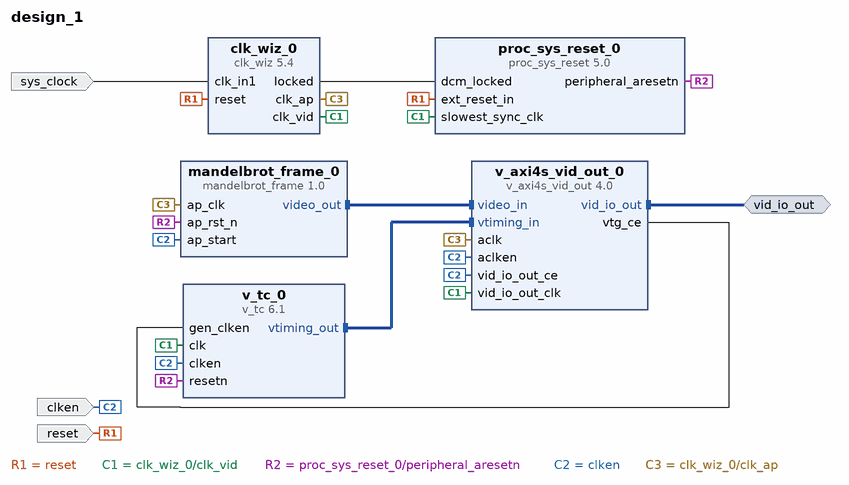
[diagram p0: block diagram of the top level]
# Vivado block design design_1, xc7a35tcpg236-1, Vivado 2017.4
create_bd_design design_1

create_bd_intf_port -mode Master -vlnv xilinx.com:interface:vid_io_rtl:1.0 vid_io_out
create_bd_port -dir I -type clk sys_clock
set_property -dict {CONFIG.FREQ_HZ 100000000 CONFIG.PHASE 0.000} [get_bd_ports sys_clock]
create_bd_port -dir I -type rst reset
set_property -dict {CONFIG.POLARITY ACTIVE_HIGH} [get_bd_ports reset]
create_bd_port -dir I -type ce clken

create_bd_cell -type ip -vlnv xilinx.com:ip:clk_wiz:5.4 clk_wiz_0
set_property -dict [list \
  CONFIG.CLKOUT2_USED true \
  CONFIG.NUM_OUT_CLKS 2 \
  CONFIG.CLK_OUT1_PORT clk_ap \
  CONFIG.CLK_OUT2_PORT clk_vid \
  CONFIG.CLKOUT1_REQUESTED_OUT_FREQ 450.000 \
  CONFIG.CLKOUT2_REQUESTED_OUT_FREQ 25.000 \
  CONFIG.MMCM_DIVCLK_DIVIDE 1 \
  CONFIG.MMCM_CLKFBOUT_MULT_F 9.000 \
  CONFIG.MMCM_CLKOUT0_DIVIDE_F 2.000 \
  CONFIG.MMCM_CLKOUT1_DIVIDE 36 \
  CONFIG.USE_BOARD_FLOW true \
  CONFIG.CLK_IN1_BOARD_INTERFACE sys_clock \
  CONFIG.RESET_BOARD_INTERFACE reset \
  CONFIG.CLKOUT1_JITTER 103.830 \
  CONFIG.CLKOUT1_PHASE_ERROR 105.461 \
  CONFIG.CLKOUT2_JITTER 183.467 \
  CONFIG.CLKOUT2_PHASE_ERROR 105.461 \
] [get_bd_cells clk_wiz_0]
create_bd_cell -type ip -vlnv xilinx.com:ip:proc_sys_reset:5.0 proc_sys_reset_0
set_property -dict {CONFIG.USE_BOARD_FLOW true CONFIG.RESET_BOARD_INTERFACE reset} [get_bd_cells proc_sys_reset_0]
create_bd_cell -type ip -vlnv xilinx.com:ip:v_tc:6.1 v_tc_0
set_property -dict [list \
  CONFIG.HAS_AXI4_LITE false \
  CONFIG.VIDEO_MODE 640x480p \
  CONFIG.enable_detection false \
  CONFIG.vertical_blank_generation true \
  CONFIG.horizontal_blank_generation true \
] [get_bd_cells v_tc_0]
create_bd_cell -type ip -vlnv xilinx.com:ip:v_axi4s_vid_out:4.0 v_axi4s_vid_out_0
set_property -dict {CONFIG.C_HAS_ASYNC_CLK 1} [get_bd_cells v_axi4s_vid_out_0]
create_bd_cell -type ip -vlnv tmc:hls:mandelbrot_frame:1.0 mandelbrot_frame_0

# ---- connections ----

connect_bd_intf_net [get_bd_intf_pins mandelbrot_frame_0/video_out] [get_bd_intf_pins v_axi4s_vid_out_0/video_in]
connect_bd_intf_net [get_bd_intf_pins v_tc_0/vtiming_out] [get_bd_intf_pins v_axi4s_vid_out_0/vtiming_in]
connect_bd_intf_net [get_bd_intf_ports vid_io_out] [get_bd_intf_pins v_axi4s_vid_out_0/vid_io_out]
connect_bd_net [get_bd_ports sys_clock] [get_bd_pins clk_wiz_0/clk_in1]
connect_bd_net [get_bd_ports reset] [get_bd_pins clk_wiz_0/reset] [get_bd_pins proc_sys_reset_0/ext_reset_in]
connect_bd_net [get_bd_pins clk_wiz_0/clk_vid] \
  [get_bd_pins v_tc_0/clk] [get_bd_pins proc_sys_reset_0/slowest_sync_clk] [get_bd_pins v_axi4s_vid_out_0/vid_io_out_clk]
connect_bd_net [get_bd_pins clk_wiz_0/locked] [get_bd_pins proc_sys_reset_0/dcm_locked]
connect_bd_net [get_bd_pins proc_sys_reset_0/peripheral_aresetn] [get_bd_pins v_tc_0/resetn] [get_bd_pins mandelbrot_frame_0/ap_rst_n]
connect_bd_net [get_bd_ports clken] \
  [get_bd_pins v_tc_0/clken] [get_bd_pins v_axi4s_vid_out_0/aclken] [get_bd_pins v_axi4s_vid_out_0/vid_io_out_ce] \
  [get_bd_pins mandelbrot_frame_0/ap_start]
connect_bd_net [get_bd_pins clk_wiz_0/clk_ap] [get_bd_pins v_axi4s_vid_out_0/aclk] [get_bd_pins mandelbrot_frame_0/ap_clk]
connect_bd_net [get_bd_pins v_axi4s_vid_out_0/vtg_ce] [get_bd_pins v_tc_0/gen_clken]

validate_bd_design
save_bd_design
